# Altium schematic sheet Barrido_1fuente.SchDoc
size A4; SheetNumber: 6; SheetTotal: 6
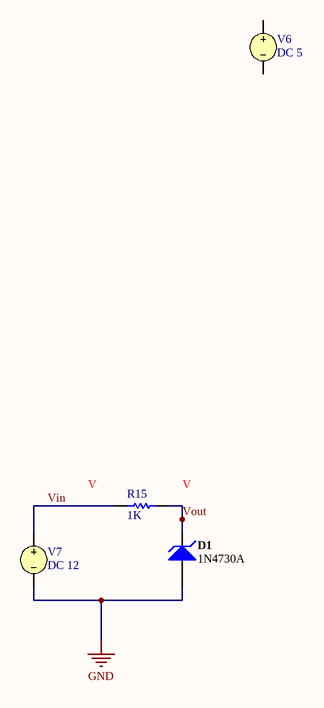
[diagram p0: Barrido_1fuente.SchDoc]

## Parts
D1  1N4730A  [FAIR-DO-41-2_V]
R15  value 1K  (hidden comment: Resistor)
V6  DC 5
V7  DC 12

## Nets
GND: D1.1(A) V7.2
Vin: R15.1 V7.1
Vout: D1.2(K) R15.2

Not connected (* = marked no-connect by the designer): V6 1 2

## Library data of the parts
D1 = CMP-0892-00029-1: Zener Diode, 3.9V, 1W, 5%, -65 to 200 degC, 2-Pin DO-41, Body 2.72 x 5.2 mm, RoHS; Manufacturer: Fairchild Semiconductor; Test Current IZ (mA): 64; ZZ (Max) (ohm): 9; IR (uA): 50; VZ (Min.) (V): 3.705; VZ (Max.) (V): 4.095; PD (W): 1; ComponentLink2Description: Datasheet; Operating and Storage Temperature Range: -65 to 200 degC; DatasheetVersion: Rev. H3; PackageReference: DO-41-2; ComponentLink3Description: Package Specification; RoHS: TRUE; PackageVersion: Rev. 2; PartNumber: 1N4730A; ComponentLink2URL: http://www.fairchildsemi.com/ds/1N/1N4744A.pdf; Tolerance: 5%; ComponentLink1Description: Manufacturer URL; ComponentLink1URL: http://www.fairchildsemi.com/; Mounting Technology: Through Hole; ComponentLink3URL: http://www.fairchildsemi.com/dwg/DO/DO41A.pdf; PackageDescription: 2-Pin Axial leaded, Body 2.72 x 5.2 mm, Lead Spread 25.4 mm
R15 = Resistor: TC1: 0; SimulationGenericComponent: True; TC2: 0
V6 = VSRC: Voltage Source; Note: PCB Footprint - Not required; AC Magnitude: 1; AC Phase: 0; Value: 5; Published: 8-Jun-2000; LatestRevisionDate: 17-Jul-2002; LatestRevisionNote: Re-released for DXP Platform.; PackageReference: Not Applicable; Publisher: Altium Limited
V7 = VSRC: Voltage Source; Note: PCB Footprint - Not required; AC Magnitude: 1; AC Phase: 0; Value: 12; Published: 8-Jun-2000; LatestRevisionDate: 17-Jul-2002; LatestRevisionNote: Re-released for DXP Platform.; PackageReference: Not Applicable; Publisher: Altium Limited